# Altium schematic sheet 2_Sheet_2 copy.schdoc
size 302 x 215 mm; Name: A_A4; Symbol: A_A4; Device: A_A4; @Project Name: BackupProjects_chlehmann_personal_0_20260513; REV: 1.0; Date: 2026-05-11; Sheet: 1/1; Draw By: chlehmann; Company: Your Company; Convert to PCB: yes; Add into BOM: yes; spicePre: .; @Page No: 2; @Page Count: 2; @Schematic Name: Klettie_2026 Pro; @Board Name: Klettie_2026 Pro; @Update Date: 2026-05-13; @Create Time: 10:46:50; @Update Time: 12:58:38; @Page Name: Sheet_2 copy; @Create Date: 2026-05-13
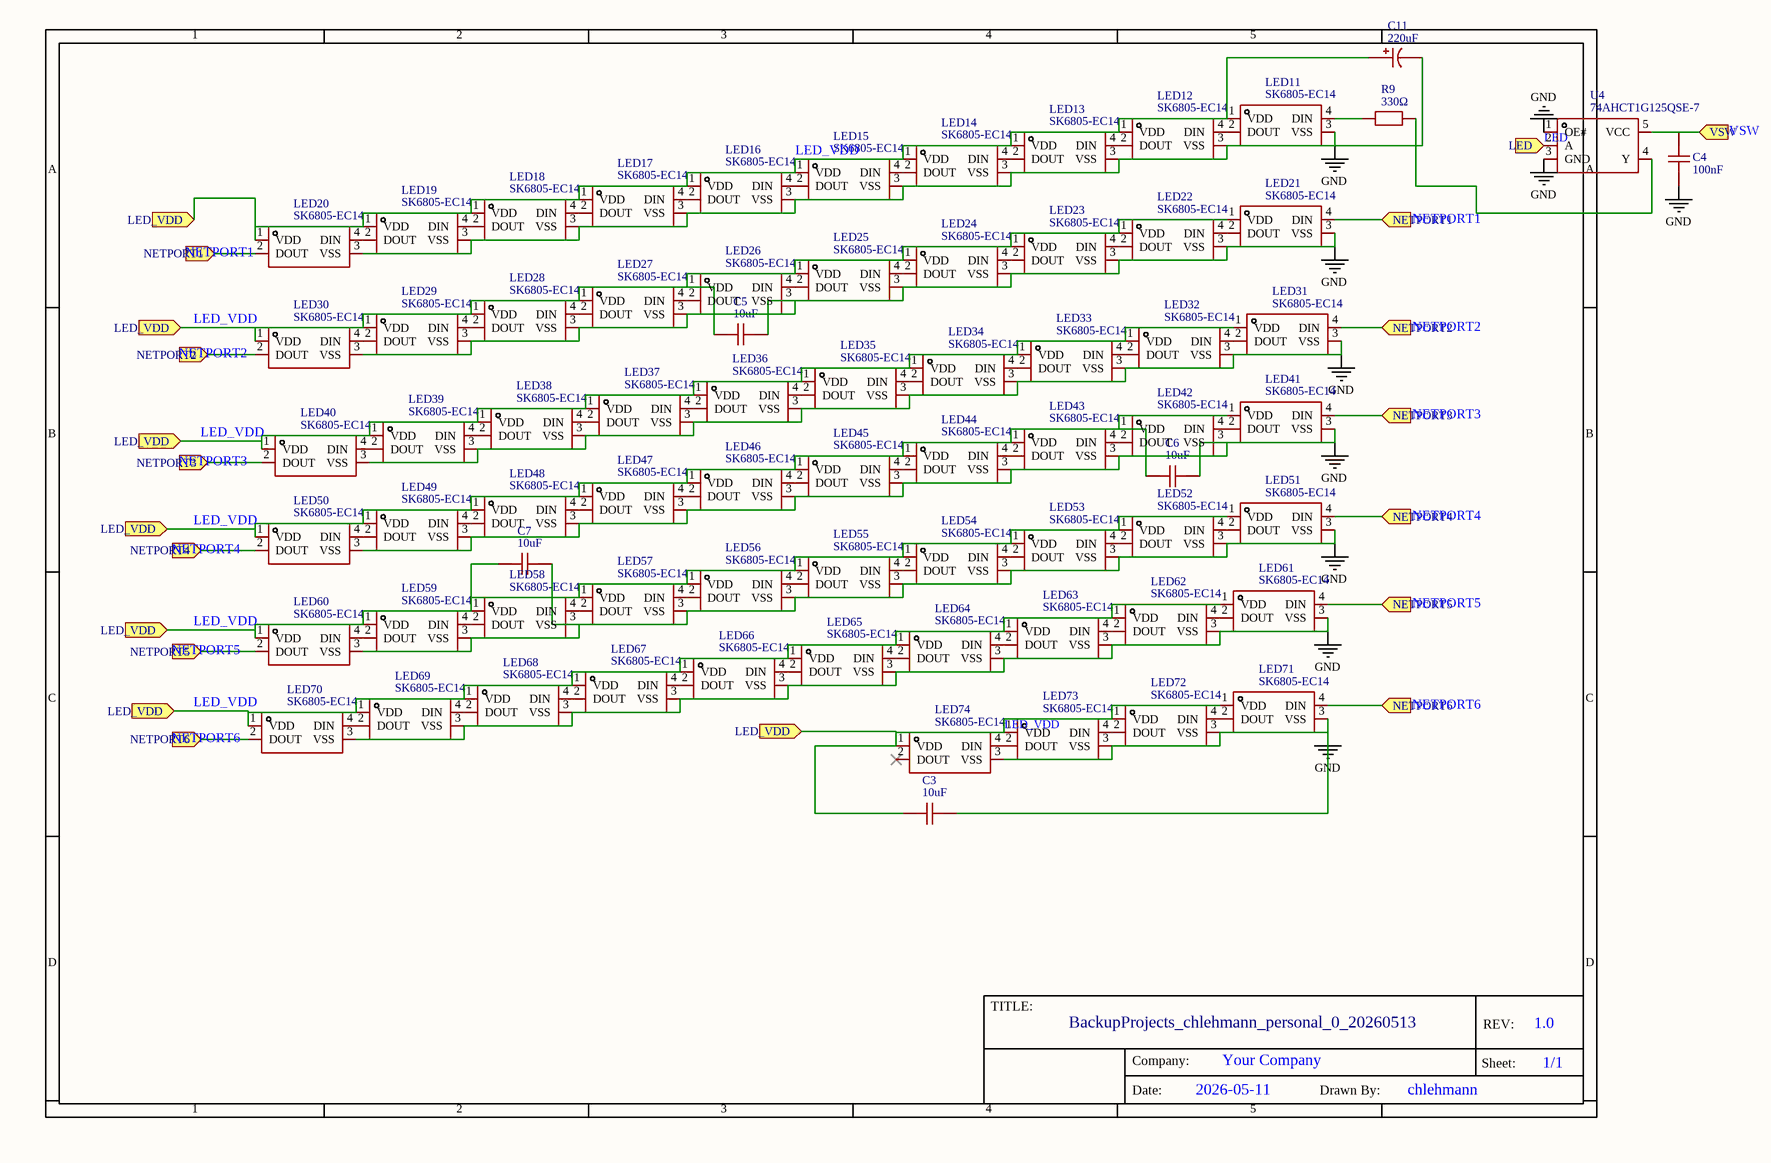
[diagram p0: 2_Sheet_2 copy.schdoc]

## Parts
C3  10uF  [C0603]
C4  100nF  [C0603]
C5  10uF  [C0603]
C6  10uF  [C0603]
C7  10uF  [C0603]
C11  220uF  [CAP-SMD_BD6.3-L6.6-W6.6-LS7.2-FD]
LED11  SK6805-EC14  [LED-SMD_4P-L1.4-W1.4-TL]
LED12  SK6805-EC14  [LED-SMD_4P-L1.4-W1.4-TL]
LED13  SK6805-EC14  [LED-SMD_4P-L1.4-W1.4-TL]
LED14  SK6805-EC14  [LED-SMD_4P-L1.4-W1.4-TL]
LED15  SK6805-EC14  [LED-SMD_4P-L1.4-W1.4-TL]
LED16  SK6805-EC14  [LED-SMD_4P-L1.4-W1.4-TL]
LED17  SK6805-EC14  [LED-SMD_4P-L1.4-W1.4-TL]
LED18  SK6805-EC14  [LED-SMD_4P-L1.4-W1.4-TL]
LED19  SK6805-EC14  [LED-SMD_4P-L1.4-W1.4-TL]
LED20  SK6805-EC14  [LED-SMD_4P-L1.4-W1.4-TL]
LED21  SK6805-EC14  [LED-SMD_4P-L1.4-W1.4-TL]
LED22  SK6805-EC14  [LED-SMD_4P-L1.4-W1.4-TL]
LED23  SK6805-EC14  [LED-SMD_4P-L1.4-W1.4-TL]
LED24  SK6805-EC14  [LED-SMD_4P-L1.4-W1.4-TL]
LED25  SK6805-EC14  [LED-SMD_4P-L1.4-W1.4-TL]
LED26  SK6805-EC14  [LED-SMD_4P-L1.4-W1.4-TL]
LED27  SK6805-EC14  [LED-SMD_4P-L1.4-W1.4-TL]
LED28  SK6805-EC14  [LED-SMD_4P-L1.4-W1.4-TL]
LED29  SK6805-EC14  [LED-SMD_4P-L1.4-W1.4-TL]
LED30  SK6805-EC14  [LED-SMD_4P-L1.4-W1.4-TL]
LED31  SK6805-EC14  [LED-SMD_4P-L1.4-W1.4-TL]
LED32  SK6805-EC14  [LED-SMD_4P-L1.4-W1.4-TL]
LED33  SK6805-EC14  [LED-SMD_4P-L1.4-W1.4-TL]
LED34  SK6805-EC14  [LED-SMD_4P-L1.4-W1.4-TL]
LED35  SK6805-EC14  [LED-SMD_4P-L1.4-W1.4-TL]
LED36  SK6805-EC14  [LED-SMD_4P-L1.4-W1.4-TL]
LED37  SK6805-EC14  [LED-SMD_4P-L1.4-W1.4-TL]
LED38  SK6805-EC14  [LED-SMD_4P-L1.4-W1.4-TL]
LED39  SK6805-EC14  [LED-SMD_4P-L1.4-W1.4-TL]
LED40  SK6805-EC14  [LED-SMD_4P-L1.4-W1.4-TL]
LED41  SK6805-EC14  [LED-SMD_4P-L1.4-W1.4-TL]
LED42  SK6805-EC14  [LED-SMD_4P-L1.4-W1.4-TL]
LED43  SK6805-EC14  [LED-SMD_4P-L1.4-W1.4-TL]
LED44  SK6805-EC14  [LED-SMD_4P-L1.4-W1.4-TL]
LED45  SK6805-EC14  [LED-SMD_4P-L1.4-W1.4-TL]
LED46  SK6805-EC14  [LED-SMD_4P-L1.4-W1.4-TL]
LED47  SK6805-EC14  [LED-SMD_4P-L1.4-W1.4-TL]
LED48  SK6805-EC14  [LED-SMD_4P-L1.4-W1.4-TL]
LED49  SK6805-EC14  [LED-SMD_4P-L1.4-W1.4-TL]
LED50  SK6805-EC14  [LED-SMD_4P-L1.4-W1.4-TL]
LED51  SK6805-EC14  [LED-SMD_4P-L1.4-W1.4-TL]
LED52  SK6805-EC14  [LED-SMD_4P-L1.4-W1.4-TL]
LED53  SK6805-EC14  [LED-SMD_4P-L1.4-W1.4-TL]
LED54  SK6805-EC14  [LED-SMD_4P-L1.4-W1.4-TL]
LED55  SK6805-EC14  [LED-SMD_4P-L1.4-W1.4-TL]
LED56  SK6805-EC14  [LED-SMD_4P-L1.4-W1.4-TL]
LED57  SK6805-EC14  [LED-SMD_4P-L1.4-W1.4-TL]
LED58  SK6805-EC14  [LED-SMD_4P-L1.4-W1.4-TL]
LED59  SK6805-EC14  [LED-SMD_4P-L1.4-W1.4-TL]
LED60  SK6805-EC14  [LED-SMD_4P-L1.4-W1.4-TL]
LED61  SK6805-EC14  [LED-SMD_4P-L1.4-W1.4-TL]
LED62  SK6805-EC14  [LED-SMD_4P-L1.4-W1.4-TL]
LED63  SK6805-EC14  [LED-SMD_4P-L1.4-W1.4-TL]
LED64  SK6805-EC14  [LED-SMD_4P-L1.4-W1.4-TL]
LED65  SK6805-EC14  [LED-SMD_4P-L1.4-W1.4-TL]
LED66  SK6805-EC14  [LED-SMD_4P-L1.4-W1.4-TL]
LED67  SK6805-EC14  [LED-SMD_4P-L1.4-W1.4-TL]
LED68  SK6805-EC14  [LED-SMD_4P-L1.4-W1.4-TL]
LED69  SK6805-EC14  [LED-SMD_4P-L1.4-W1.4-TL]
LED70  SK6805-EC14  [LED-SMD_4P-L1.4-W1.4-TL]
LED71  SK6805-EC14  [LED-SMD_4P-L1.4-W1.4-TL]
LED72  SK6805-EC14  [LED-SMD_4P-L1.4-W1.4-TL]
LED73  SK6805-EC14  [LED-SMD_4P-L1.4-W1.4-TL]
LED74  SK6805-EC14  [LED-SMD_4P-L1.4-W1.4-TL]
R9  330Ω  [R0603]
U4  74AHCT1G125QSE-7  [SOT-353-5_L2.0-W1.3-P0.65-LS2.1-BR]

## Ports
LED (in), LED_VDD (in), NETPORT1 (in), NETPORT2 (in), NETPORT3 (in), NETPORT4 (in), NETPORT5 (in), NETPORT6 (in), VSW (in)

## Nets
GND: C3.2 C4.1 C5.2 C6.2 C7.2 C11.2 LED11.3(VSS) LED12.3(VSS) LED13.3(VSS) LED14.3(VSS) LED15.3(VSS) LED16.3(VSS) LED17.3(VSS) LED18.3(VSS) LED19.3(VSS) LED20.3(VSS) LED21.3(VSS) LED22.3(VSS) LED23.3(VSS) LED24.3(VSS) LED25.3(VSS) LED26.3(VSS) LED27.3(VSS) LED28.3(VSS) LED29.3(VSS) LED30.3(VSS) LED31.3(VSS) LED32.3(VSS) LED33.3(VSS) LED34.3(VSS) LED35.3(VSS) LED36.3(VSS) LED37.3(VSS) LED38.3(VSS) LED39.3(VSS) LED40.3(VSS) LED41.3(VSS) LED42.3(VSS) LED43.3(VSS) LED44.3(VSS) LED45.3(VSS) LED46.3(VSS) LED47.3(VSS) LED48.3(VSS) LED49.3(VSS) LED50.3(VSS) LED51.3(VSS) LED52.3(VSS) LED53.3(VSS) LED54.3(VSS) LED55.3(VSS) LED56.3(VSS) LED57.3(VSS) LED58.3(VSS) LED59.3(VSS) LED60.3(VSS) LED61.3(VSS) LED62.3(VSS) LED63.3(VSS) LED64.3(VSS) LED65.3(VSS) LED66.3(VSS) LED67.3(VSS) LED68.3(VSS) LED69.3(VSS) LED70.3(VSS) LED71.3(VSS) LED72.3(VSS) LED73.3(VSS) LED74.3(VSS) U4.1(OE#) U4.3(GND)
LED: U4.2(A) ; port LED
LED_VDD: C3.1 C5.1 C6.1 C7.1 C11.1 LED11.1(VDD) LED12.1(VDD) LED13.1(VDD) LED14.1(VDD) LED15.1(VDD) LED16.1(VDD) LED17.1(VDD) LED18.1(VDD) LED19.1(VDD) LED20.1(VDD) LED21.1(VDD) LED22.1(VDD) LED23.1(VDD) LED24.1(VDD) LED25.1(VDD) LED26.1(VDD) LED27.1(VDD) LED28.1(VDD) LED29.1(VDD) LED30.1(VDD) LED31.1(VDD) LED32.1(VDD) LED33.1(VDD) LED34.1(VDD) LED35.1(VDD) LED36.1(VDD) LED37.1(VDD) LED38.1(VDD) LED39.1(VDD) LED40.1(VDD) LED41.1(VDD) LED42.1(VDD) LED43.1(VDD) LED44.1(VDD) LED45.1(VDD) LED46.1(VDD) LED47.1(VDD) LED48.1(VDD) LED49.1(VDD) LED50.1(VDD) LED51.1(VDD) LED52.1(VDD) LED53.1(VDD) LED54.1(VDD) LED55.1(VDD) LED56.1(VDD) LED57.1(VDD) LED58.1(VDD) LED59.1(VDD) LED60.1(VDD) LED61.1(VDD) LED62.1(VDD) LED63.1(VDD) LED64.1(VDD) LED65.1(VDD) LED66.1(VDD) LED67.1(VDD) LED68.1(VDD) LED69.1(VDD) LED70.1(VDD) LED71.1(VDD) LED72.1(VDD) LED73.1(VDD) LED74.1(VDD) ; port LED_VDD
NETPORT1: LED20.2(DOUT) LED21.4(DIN) ; port NETPORT1
NETPORT2: LED30.2(DOUT) LED31.4(DIN) ; port NETPORT2
NETPORT3: LED40.2(DOUT) LED41.4(DIN) ; port NETPORT3
NETPORT4: LED50.2(DOUT) LED51.4(DIN) ; port NETPORT4
NETPORT5: LED60.2(DOUT) LED61.4(DIN) ; port NETPORT5
NETPORT6: LED70.2(DOUT) LED71.4(DIN) ; port NETPORT6
VSW: C4.2 U4.5(VCC) ; port VSW
NetLED11_2: LED11.2(DOUT) LED12.4(DIN)
NetLED11_4: LED11.4(DIN) R9.1
NetLED12_2: LED12.2(DOUT) LED13.4(DIN)
NetLED13_2: LED13.2(DOUT) LED14.4(DIN)
NetLED14_2: LED14.2(DOUT) LED15.4(DIN)
NetLED15_2: LED15.2(DOUT) LED16.4(DIN)
NetLED16_2: LED16.2(DOUT) LED17.4(DIN)
NetLED17_2: LED17.2(DOUT) LED18.4(DIN)
NetLED18_2: LED18.2(DOUT) LED19.4(DIN)
NetLED19_2: LED19.2(DOUT) LED20.4(DIN)
NetLED21_2: LED21.2(DOUT) LED22.4(DIN)
NetLED22_2: LED22.2(DOUT) LED23.4(DIN)
NetLED23_2: LED23.2(DOUT) LED24.4(DIN)
NetLED24_2: LED24.2(DOUT) LED25.4(DIN)
NetLED25_2: LED25.2(DOUT) LED26.4(DIN)
NetLED26_2: LED26.2(DOUT) LED27.4(DIN)
NetLED27_2: LED27.2(DOUT) LED28.4(DIN)
NetLED28_2: LED28.2(DOUT) LED29.4(DIN)
NetLED29_2: LED29.2(DOUT) LED30.4(DIN)
NetLED31_2: LED31.2(DOUT) LED32.4(DIN)
NetLED32_2: LED32.2(DOUT) LED33.4(DIN)
NetLED33_2: LED33.2(DOUT) LED34.4(DIN)
NetLED34_2: LED34.2(DOUT) LED35.4(DIN)
NetLED35_2: LED35.2(DOUT) LED36.4(DIN)
NetLED36_2: LED36.2(DOUT) LED37.4(DIN)
NetLED37_2: LED37.2(DOUT) LED38.4(DIN)
NetLED38_2: LED38.2(DOUT) LED39.4(DIN)
NetLED39_2: LED39.2(DOUT) LED40.4(DIN)
NetLED41_2: LED41.2(DOUT) LED42.4(DIN)
NetLED42_2: LED42.2(DOUT) LED43.4(DIN)
NetLED43_2: LED43.2(DOUT) LED44.4(DIN)
NetLED44_2: LED44.2(DOUT) LED45.4(DIN)
NetLED45_2: LED45.2(DOUT) LED46.4(DIN)
NetLED46_2: LED46.2(DOUT) LED47.4(DIN)
NetLED47_2: LED47.2(DOUT) LED48.4(DIN)
NetLED48_2: LED48.2(DOUT) LED49.4(DIN)
NetLED49_2: LED49.2(DOUT) LED50.4(DIN)
NetLED51_2: LED51.2(DOUT) LED52.4(DIN)
NetLED52_2: LED52.2(DOUT) LED53.4(DIN)
NetLED53_2: LED53.2(DOUT) LED54.4(DIN)
NetLED54_2: LED54.2(DOUT) LED55.4(DIN)
NetLED55_2: LED55.2(DOUT) LED56.4(DIN)
NetLED56_2: LED56.2(DOUT) LED57.4(DIN)
NetLED57_2: LED57.2(DOUT) LED58.4(DIN)
NetLED58_2: LED58.2(DOUT) LED59.4(DIN)
NetLED59_2: LED59.2(DOUT) LED60.4(DIN)
NetLED61_2: LED61.2(DOUT) LED62.4(DIN)
NetLED62_2: LED62.2(DOUT) LED63.4(DIN)
NetLED63_2: LED63.2(DOUT) LED64.4(DIN)
NetLED64_2: LED64.2(DOUT) LED65.4(DIN)
NetLED65_2: LED65.2(DOUT) LED66.4(DIN)
NetLED66_2: LED66.2(DOUT) LED67.4(DIN)
NetLED67_2: LED67.2(DOUT) LED68.4(DIN)
NetLED68_2: LED68.2(DOUT) LED69.4(DIN)
NetLED69_2: LED69.2(DOUT) LED70.4(DIN)
NetLED71_2: LED71.2(DOUT) LED72.4(DIN)
NetLED72_2: LED72.2(DOUT) LED73.4(DIN)
NetLED73_2: LED73.2(DOUT) LED74.4(DIN)
NetR9_2: R9.2 U4.4(Y)

Not connected (* = marked no-connect by the designer): LED74 2(DOUT)*

## Notes on the sheet
- Labels drawn without touching a wire or pin: NETPORT1, NETPORT2, NETPORT3, NETPORT4, NETPORT5, NETPORT6, VSW
- 1
- 2
- 3
- 4
- 5
- A
- B
- C
- D
- TITLE:
- BackupProjects_chlehmann_personal_0_20260513
- REV:
- 1.0
- Date:
- Company:
- 2026-05-11
- Your Company
- Drawn By:
- chlehmann
- Sheet:
- 1/1

## Library data of the parts
C3 C5-C7 = 10uF: Manufacturer: SAMSUNG(三星); Manufacturer Part: CL10A106KP8NNNC; Convert to PCB: yes; nameAlias: Value; Symbol: 10uF; Device: 10uF; Supplier: LCSC; Supplier Part: C19702; JLCPCB Part Class: Basic Part; Add into BOM: yes; Origin Footprint: C0603; spicePre: C; spiceSymbolName: CL10A106KP8NNNC
C4 = 100nF: Manufacturer: HRE(芯声); Manufacturer Part: CGA0603X7R104K250JT; Convert to PCB: yes; nameAlias: Value; Contributor: lcsc; Symbol: 100nF; Device: 100nF; Supplier: LCSC; Supplier Part: C6119861; JLCPCB Part Class: Extended Part; Add into BOM: yes; Origin Footprint: C0603; spicePre: C; spiceSymbolName: CGA0603X7R104K250JT
C11 = 220uF: Manufacturer: KNSCHA(科尼盛); Manufacturer Part: RVT220UF6.3V67RV0014; Convert to PCB: yes; Contributor: LCSC; nameAlias: Value; Symbol: 220uF; Device: 220uF; Supplier: LCSC; Supplier Part: C2895278; JLCPCB Part Class: Extended Part; Add into BOM: yes; Origin Footprint: CAP-SMD_BD6.3-L6.6-W6.6-LS7.2-FD; spicePre: C; spiceSymbolName: RVT220UF6.3V67RV0014
LED11-LED74 = SK6805-EC14_C2909055: Manufacturer: 欧思科光电; Symbol: WS2812B-MINI; Add into BOM: yes; Device: SK6805-EC14_C2909055; LCSC Part Name: RGB三色; Supplier Part: C2909055; Manufacturer Part: SK6805-EC14; Supplier Footprint: SMD,1.4x1.4mm; JLCPCB Part Class: Extended Part; Datasheet: https://atta.szlcsc.com/upload/public/pdf/source/20220216/66E0AA6A2A862BC6ACA495BCDA772BF7.pdf; Supplier: LCSC; Convert to PCB: yes
R9 = 330Ω: Manufacturer: Viking(光颉); Manufacturer Part: AR03BTCX3300; Convert to PCB: yes; nameAlias: Value; Contributor: lcsc; Symbol: 330Ω; Device: 330Ω; Supplier: LCSC; Supplier Part: C2984350; JLCPCB Part Class: Extended Part; Add into BOM: yes; Origin Footprint: R0603; spicePre: R; spiceSymbolName: AR03BTCX3300
U4 = 74AHCT1G125QSE-7: Manufacturer: DIODES(美台); Convert to PCB: yes; Contributor: lcsc; Symbol: 74AHCT1G125QSE-7; Device: 74AHCT1G125QSE-7; Supplier: LCSC; Supplier Part: C7039245; Manufacturer Part: 74AHCT1G125QSE-7; JLCPCB Part Class: Extended Part; Add into BOM: yes; Origin Footprint: SOT-353-5_L2.0-W1.3-P0.65-LS2.1-BR; spicePre: U; spiceSymbolName: 74AHCT1G125QSE-7